# EAGLE design Moteino-IAQ-Shield (EAGLE 8.1.1)
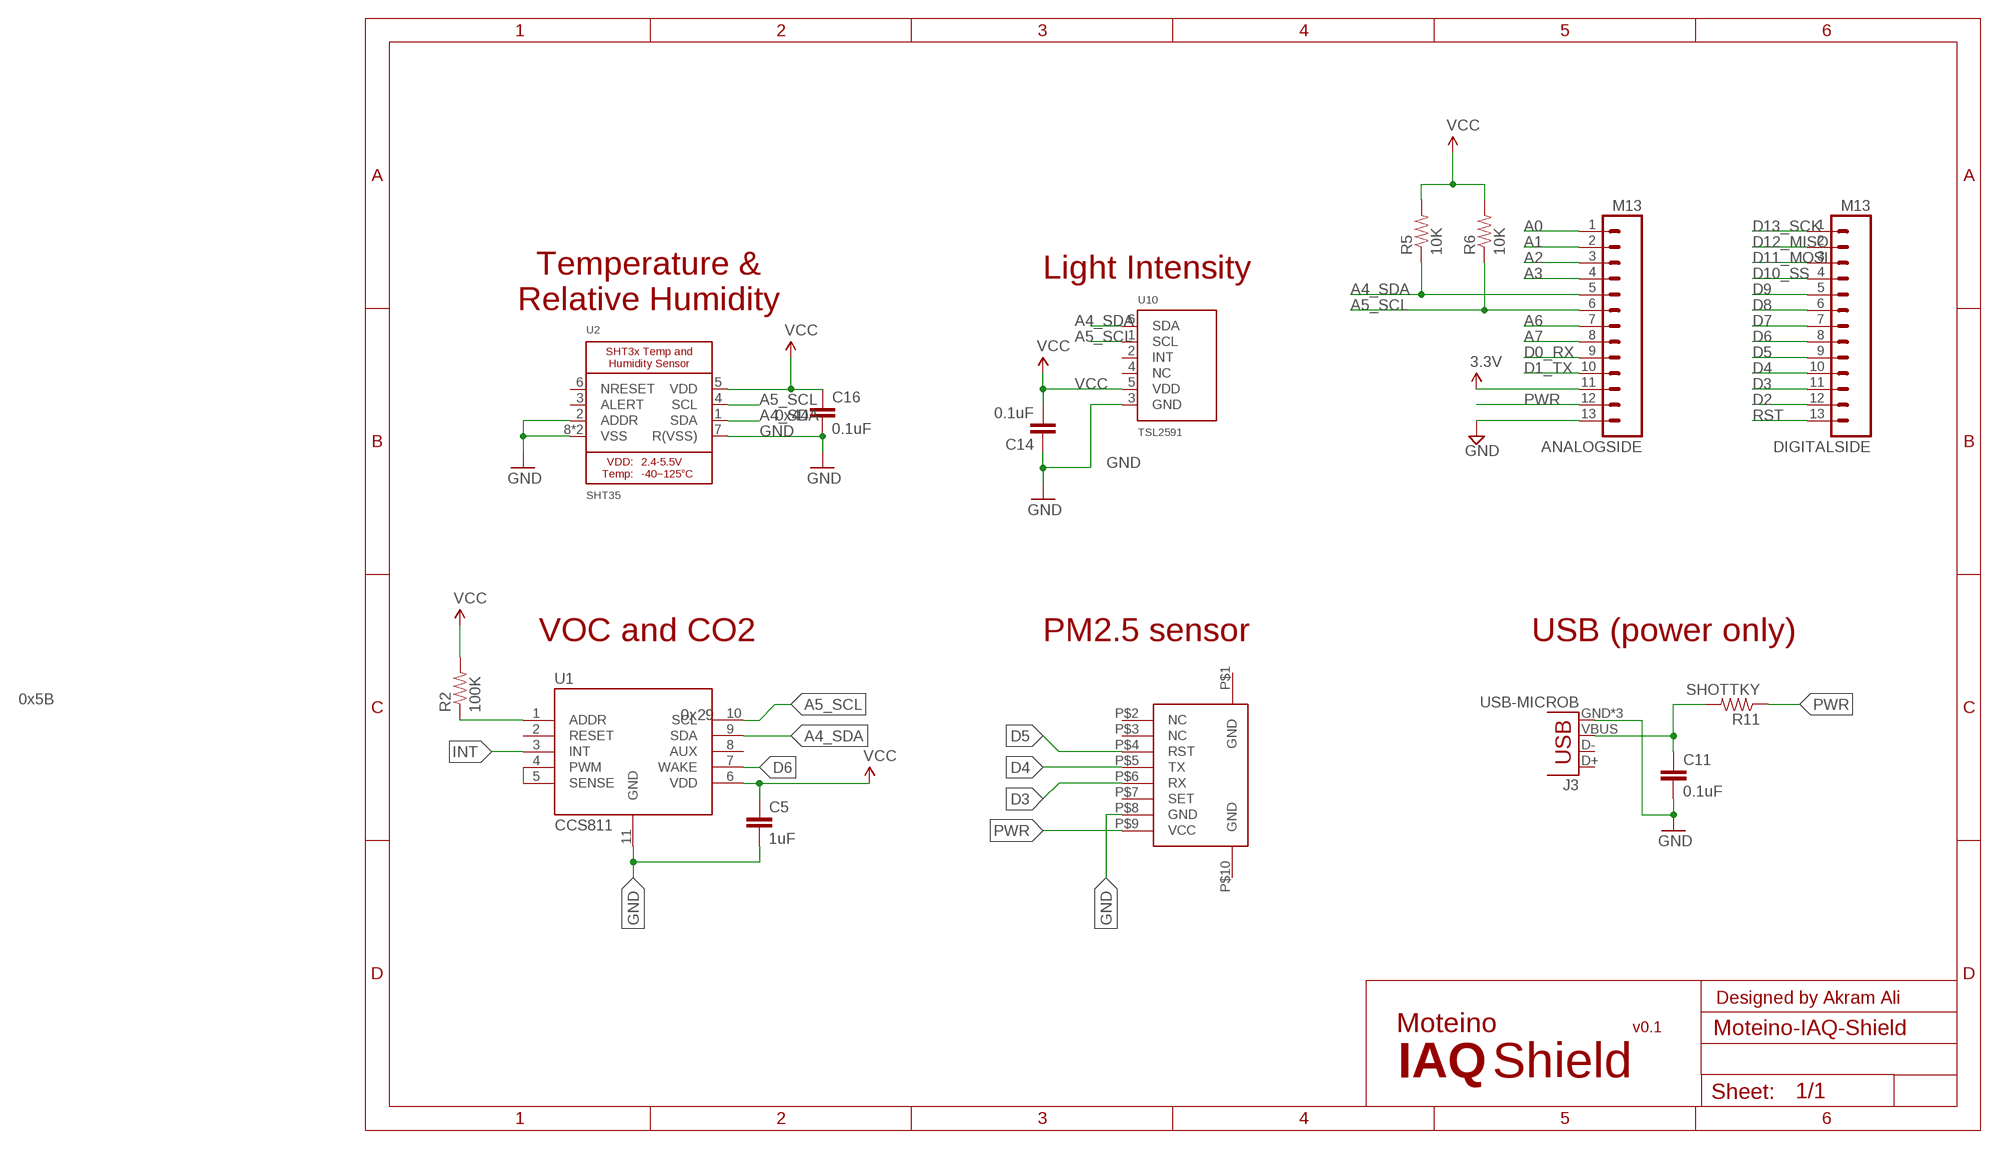
[diagram p0: schematic, sheet 1]

## Parts
ANALOGSIDE  M13  [1X13]
C5  1uF  CAP0805  [0805]
C11  0.1uF  CAP0805  [0805]
C14  0.1uF  CAP0805  [0805]
C16  0.1uF  CAP0805  [0805]
DIGITALSIDE  M13  [1X13]
J3  USB-MICROB  [USB-MICROB]
R2  100K  RESISTOR0805-RES  [0805]
R5  10K  RESISTOR0805-RES  [0805]
R6  10K  RESISTOR0805-RES  [0805]
R11  SHOTTKY  RESISTOR0805-RES  [0805]
U1  CCS811  CCS811-I2C  [LGA]
U2  SHT35  SHT3X  [SHT3X]
U10  TSL2591  LIGHT_TSL2591  [DFN6_TAOS]
U$1  PMS5003/7003  0532610871  [0532610871]

## Nets
A0: ANALOGSIDE.1
A1: ANALOGSIDE.2
A2: ANALOGSIDE.3
A3: ANALOGSIDE.4
A4_SDA: ANALOGSIDE.5 R5.1 U1.9(SDA) U2.1(SDA) U10.6(SDA)
A5_SCL: ANALOGSIDE.6 R6.1 U1.10(SCL) U2.4(SCL) U10.1(SCL)
A6: ANALOGSIDE.7
A7: ANALOGSIDE.8
D0_RX: ANALOGSIDE.9
D1_TX: ANALOGSIDE.10
D2: DIGITALSIDE.12
D3: DIGITALSIDE.11 U$1.P$6(RX)
D4: DIGITALSIDE.10 U$1.P$5(TX)
D5: DIGITALSIDE.9 U$1.P$4(RST)
D6: DIGITALSIDE.8 U1.7(WAKE)
D7: DIGITALSIDE.7
D8: DIGITALSIDE.6
D9: DIGITALSIDE.5
D10_SS: DIGITALSIDE.4
D11_MOSI: DIGITALSIDE.3
D12_MISO: DIGITALSIDE.2
D13_SCK: DIGITALSIDE.1
GND [power]: ANALOGSIDE.13 C5.2 C11.2 C14.1 C16.2 J3.GND J3.MT1(GND) J3.MT2(GND) U1.11(GND) U2.2(ADDR) U2.7(R(VSS)) U2.8(VSS) U2.THERMAL(VSS) U10.3(GND) U$1.P$8(GND)
INT: U1.3(INT)
N$1: R2.1 U1.1(ADDR)
N$6: U1.4(PWM) U1.5(SENSE)
PWR [power]: ANALOGSIDE.12 R11.1 U$1.P$9(VCC)
RST: DIGITALSIDE.13
VBUS: C11.1 J3.VBUS R11.2
VCC: ANALOGSIDE.11 C5.1 C14.2 C16.1 R2.2 R5.2 R6.2 U1.6(VDD) U2.5(VDD) U10.5(VDD) ; supply symbol labelled 3.3V
Unconnected: J3.D+ J3.D- U1.2(RESET) U1.8(AUX) U2.3(ALERT) U2.6(NRESET) U10.2(INT) U10.4(NC) U$1.P$1(GND) U$1.P$2(NC) U$1.P$3(NC) U$1.P$7(SET) U$1.P$10(GND)

## Notes on the sheet
- Light Intensity
- Temperature &
  Relative Humidity
- 0x44
- VOC and CO2 | PM2.5 sensor | USB (power only)
- 0x5B
- 0x29
- Designed by Akram Ali
- Moteino | v0.1
- IAQ | Shield

## Library data of the parts
ANALOGSIDE DIGITALSIDE = SparkFun-Connectors:M13: 13-pin single row .1" header
C5 = SparkFun-Passives:CAP: Capacitor Standard 0603 ceramic capacitor, and 0.1" leaded capacitor.; MPN: CC0805KKX7R7BB105
C11 = SparkFun-Capacitors:CAP: Capacitor Standard 0603 ceramic capacitor, and 0.1" leaded capacitor.; MPN: CC0805KRX7R9BB104
C14 C16 = SparkFun-Passives:CAP: Capacitor Standard 0603 ceramic capacitor, and 0.1" leaded capacitor.; MPN: CC0805KRX7R9BB104
J3 = SparkFun-Connectors:USB: USB Connectors USB-B-PTH is fully proven SKU : PRT-00139/CONN-08278 USB-miniB is fully proven SKU : PRT-00587 USB-A-PCB is untested. USB-A-H is throughly reviewed, but untested. Spark Fun Electronics SKU : PRT-00437 USB-B-SMT is throughly reviewed, but untested. Needs silkscreen touching up. USB-A-S has not been used/tested USB-MB-H has not been used/tested USB-MICROB has been used. CONN-09505; MPN: 47346-0001; PROD_ID: CONN-09505
R2 = SparkFun-Passives:RESISTOR: Resistor Basic schematic elements and footprints for 0603, 1206, and PTH resistors.; MPN: 311-100KCRCT-ND
R5 R6 = SparkFun-Resistors:RESISTOR: Resistor Basic schematic elements and footprints for 0603, 1206, and PTH resistors.; MPN: RC0805FR-0710KL
R11 = SparkFun-Passives:RESISTOR: Resistor Basic schematic elements and footprints for 0603, 1206, and PTH resistors.; MPN: SD0805S040S0R5; OC_NEWARK: unknown
U1 = CCS811:CCS811; MPN: CCS811
U2 = Adafruit SHT31:SHT3X: SHT3x - Digital Temperature and Humidity Sensor Supply Voltage: 2.4-5.5V Humidity Accuracy: SHT30 = +/-3%RH, SHT31 = +/-2%RH Temperature Sensor: -40~125°C (+/-0.3°C from 10-55C); MPN: SHT35-DIS-B
U10 = TSL2591:LIGHT_TSL2591: TSL2591 Light-To-Digital Sensor; MPN: TSL25911FN
U$1 = molex:0532610871: CONN HEADER 8POS 1.25MM R/A SMD This is a library for 8 pin Molex connector 1.25mm pitch). MPN 0532610871 Can be used to connect Plantower PMS3003/5003/7003 PM2.5 sensor Designed by Akram Ali https://github.com/akstudios

## Net classes
1 power: width 0.381 mm, clearance 0.254 mm

## Board
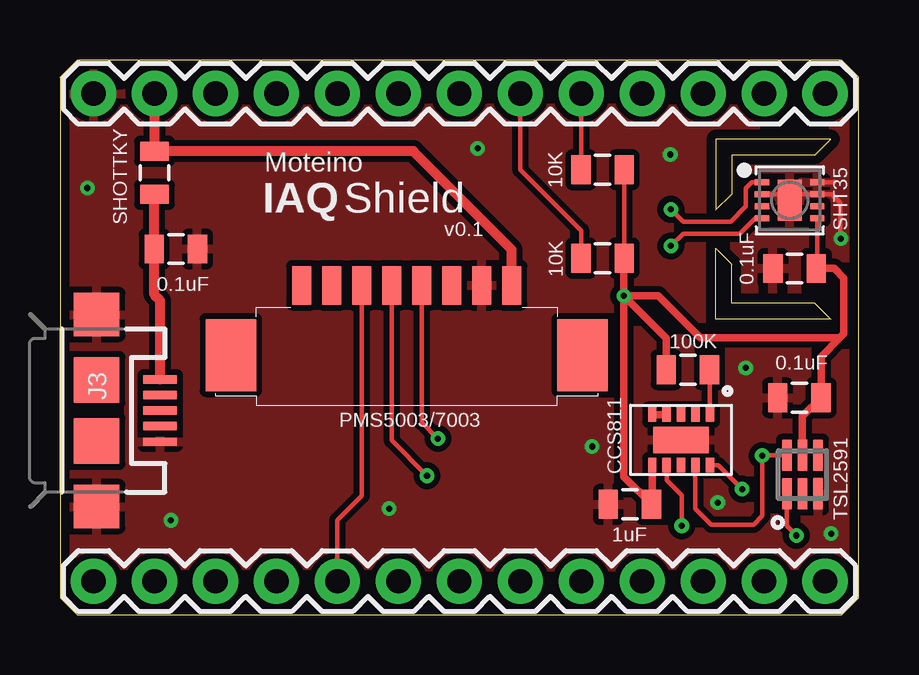
[diagram p1: board, top side]
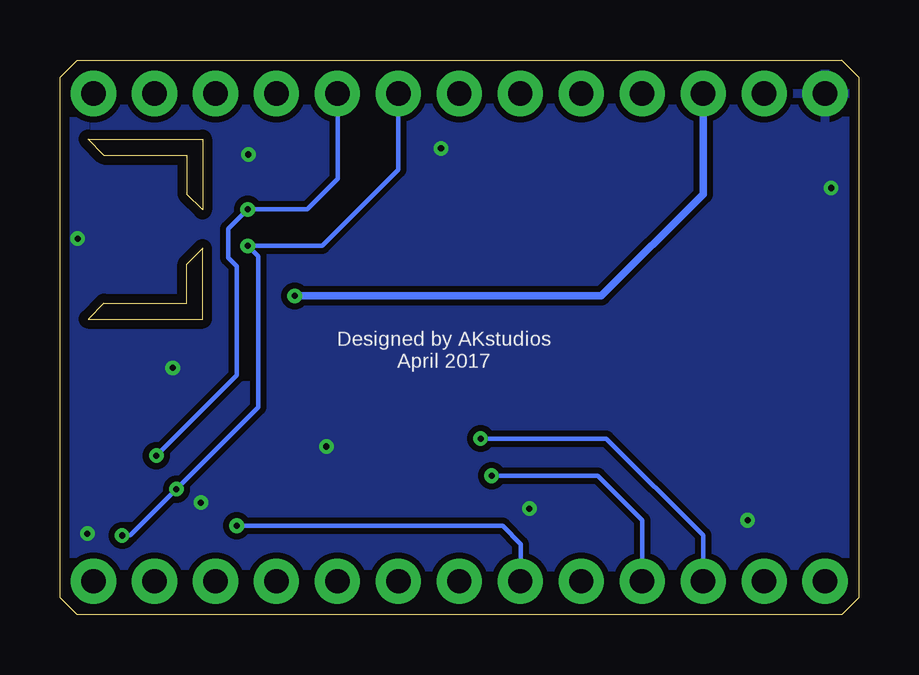
[diagram p2: board, bottom side, seen from below]

Size 33.27 x 23.11 mm. Coordinates in mm from the lower left corner, seen from the top.
Outline: 0.71,0 32.56,0 33.27,0.71 33.27,22.4 32.56,23.11 0.71,23.11 0,22.4 0,0.71 0.71,0
Outline: 32.11,19.81 27.33,19.81 27.33,16.87 27.99,17.53 27.99,19.15 31.45,19.15 32.11,19.81
Outline: 32.11,12.32 27.33,12.32 27.33,15.27 27.99,14.61 27.99,12.98 31.45,12.98 32.11,12.32
Copper layers (1*16): Top 0.0356mm / dielectric 1.5011mm / Bottom 0.0356mm
Design rules "oshpark-2layer": minimum track width 6mil, minimum drill 13mil, track to track 6mil, track to pad 6mil, pad to pad 6mil, via to via 6mil, smd to smd 6mil, copper to edge 15mil, drill to drill 6mil, minimum pad ring 7mil, minimum via ring 7mil, stop-mask expansion 2.5mil, vias tented up to drill 0mil, thermal gap 10mil

### Footprints (pad centres in the part's own frame; a part is rotated, then mirrored left to right if it is on the bottom)
1X13 = drill 1.016 pad 1.88: 1 0,0; 2 2.54,0; 3 5.08,0; 4 7.62,0; 5 10.16,0; 6 12.7,0; 7 15.24,0; 8 17.78,0; 9 20.32,0; 10 22.86,0; 11 25.4,0; 12 27.94,0; 13 30.48,0
0805 = smd 0.8 x 1.2: 1 -0.9,0; 2 0.9,0
USB-MICROB = smd 0.35 x 1.4: D+ 0,2.65; D- -0.65,2.65; GND 1.3,2.65; ID 0.65,2.65; VBUS -1.3,2.65 | smd 1.8 x 1.9: MT1 -4,0; MT2 4,0 | smd 1.9 x 1.9: P$1 -1.27,0; P$2 1.27,0
LGA = smd 0.6 x 0.35: 1 0.3,3.2; 2 0.3,2.6; 3 0.3,2; 4 0.3,1.4; 5 0.3,0.8; 6 2.4,0.8; 7 2.4,1.4; 8 2.4,2; 9 2.4,2.6; 10 2.4,3.2 | smd 1.1 x 2.3: 11 1.35,2
SHT3X = smd 0.6 x 0.25: 1 -1.15,0.75; 2 -1.15,0.25; 3 -1.15,-0.25; 4 -1.15,-0.75; 5 1.15,-0.75; 6 1.15,-0.25; 7 1.15,0.25; 8 1.15,0.75 | smd 1 x 1.7: THERMAL 0,0
DFN6_TAOS = smd 1.3 x 0.4: 1 -0.8,0.65; 2 -0.8,0; 3 -0.8,-0.65; 4 0.8,-0.65; 5 0.8,0; 6 0.8,0.65
0532610871 = smd 2.1 x 3: P$1 1.05,1.5; P$10 15.7,1.5 | smd 0.8 x 1.6: P$2 4,4.4; P$3 5.25,4.4; P$4 6.5,4.4; P$5 7.75,4.4; P$6 9,4.4; P$7 10.25,4.4; P$8 11.5,4.4; P$9 12.75,4.4

### Placement (x,y rotation side)
ANALOGSIDE  31.88,21.72 180 top
C5  23.75,4.6 180 top
C11  4.83,15.24 0 top
C14  30.81,9.04 0 top
C16  30.61,14.43 180 top
DIGITALSIDE  31.88,1.4 180 top
J3  1.52,8.51 270 top
R2  26.16,10.21 180 top
R5  22.61,18.54 0 top
R6  22.61,14.86 0 top
R11  3.94,18.41 270 top
U1  23.88,8.64 270 top
U2  30.4,17.27 0 top
U10  30.94,5.84 90 top
U$1  6.07,9.32 0 top

### Tracks (layer width: path | path; a pad name or v marks a point on that pad's centre or on a via)
A4_SDA  (via drill 0.25 pad 0.13)
  Top 0.178: U2.1 28.82,18.02 28.57,17.78 28.57,17.02 27.94,16.38 25.96,16.38 v25.45,16.89 | R5.1 21.72,18.55 ANALOGSIDE.5 | U1.9 26.48,4.41 27.13,3.76 28.91,3.76 29.26,4.12 v29.26,6.63 29.27,6.64 U10.6
  Bottom 0.178: ANALOGSIDE.5 21.71,21.71 21.71,18.16 22.98,16.89 v25.45,16.89 26.26,16.08 26.26,14.88 25.91,14.53 25.91,9.98 v29.26,6.63
A5_SCL  (via drill 0.25 pad 0.13)
  Top 0.178: U2.4 28.97,16.52 28.32,15.88 25.96,15.88 v25.45,15.37 | ANALOGSIDE.6 19.18,18.54 21.72,16 R6.1 | v28.41,5.22 v28.42,5.23 27.42,6.24 U1.10 | U10.1 30.29,3.7 v30.68,3.3
  Bottom 0.178: ANALOGSIDE.6 19.18,18.54 22.35,15.37 v25.45,15.37 25.02,14.94 25.02,8.64 v28.42,5.23 30.35,3.3 v30.68,3.3
D3  (via drill 0.25 pad 0.13)
  Top 0.178: U$1.P$6 15.07,8.02 v15.75,7.34
  Bottom 0.178: DIGITALSIDE.11 6.48,3.3 10.52,7.34 v15.75,7.34
D4  (via drill 0.25 pad 0.13)
  Top 0.178: U$1.P$5 13.82,7.26 v15.29,5.79
  Bottom 0.178: DIGITALSIDE.10 9.02,3.94 10.87,5.79 v15.29,5.79
D5
  Top 0.178: DIGITALSIDE.9 11.56,3.94 12.57,4.95 U$1.P$4
D6  (via drill 0.25 pad 0.13)
  Top 0.178: U1.7 25.28,5.61 25.91,4.98 v25.91,3.71
  Bottom 0.178: v25.91,3.71 14.83,3.71 14.07,2.95 14.07,1.42 DIGITALSIDE.8
GND  (via drill 0.25 pad 0.13)
  Top 0.178: U2.2 30.31,17.52 U2.THERMAL 30.81,17.52 U2.7 32.16,17.52 32.51,17.17 32.51,15.7 v32.54,15.67 | U2.8 32.26,18.02 32.26,18.03
  other vias: 4.62,3.94 13.72,4.42 1.14,17.78 17.4,19.43 28.57,10.29 32.13,3.38 22.17,7.01 27.41,4.67 25.43,19.18
  pour Bottom: -0.64,24 -0.64,-0.76 34.04,-0.76 34.04,24
  pour Top: -0.64,24 -0.64,-0.76 34.04,-0.76 34.04,24
N$1
  Top 0.178: U1.1 27.08,10.2 R2.1
N$6
  Top 0.305: U1.5 U1.4
PWR
  Top 0.406: ANALOGSIDE.12 R11.1 14.72,19.32 18.82,15.21 U$1.P$9
VBUS
  Top 0.406: R11.2 3.93,17.5 C11.1 3.94,15.23 3.94,13.34 4.17,13.1 J3.VBUS
VCC  (via drill 0.25 pad 0.13)
  Top 0.178: R5.2 R6.2 | U2.5 31.55,14.47 C16.1
  Top 0.305: 31.75,9.08 C14.2 | U10.5 30.94,8.27 C14.2 | v23.5,13.28 23.5,14.85 R6.2 | C14.2 31.71,10.76 32.49,11.53 | R2.2 25.26,11.52 v23.5,13.28 | v23.5,13.28 23.5,5.75 C5.1 24.68,4.62 U1.6 | v23.5,13.28 24.92,13.28 26.67,11.53 32.49,11.53 | 32.49,11.53 32.66,11.71 32.66,14.02 32.26,14.43 C16.1
  Bottom 0.305: ANALOGSIDE.11 6.48,17.53 10.72,13.28 v23.5,13.28

### Text on the board
tPlace: Moteino | IAQ | Shield | v0.1 | PMS5003/7003
bPlace: Designed by AKstudios / April 2017
tDocu: REG